# EAGLE design tv-b-gone (EAGLE 4.16)
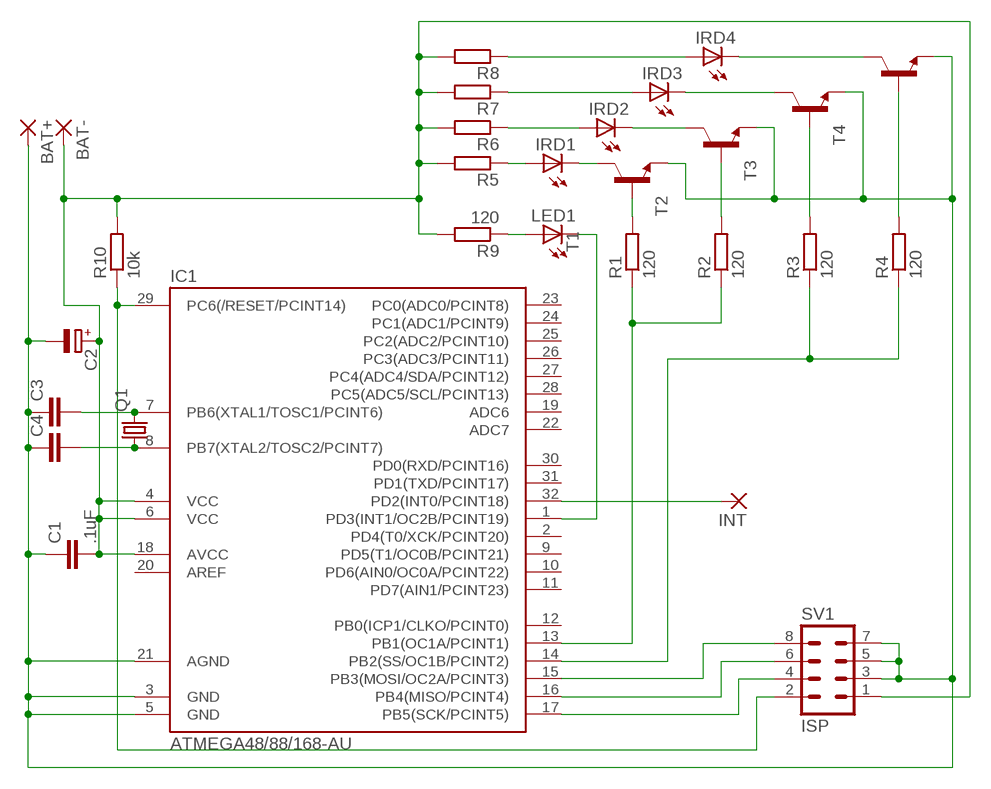
[diagram p0: schematic, sheet 1]

## Parts
BAT+  2,54/0,8  [2,54/0,8]
BAT-  2,54/0,8  [2,54/0,8]
C1  .1uF  C-EUC0603  [C0603]
C2  CPOL-EUCT3216  [CT3216]
C3  C-EUC0603  [C0603]
C4  C-EUC0603  [C0603]
IC1  ATMEGA48/88/168-AU  [TQFP32-08]
INT  1,6/0,8  [1,6/0,8]
IRD1  SFH482  [SFH482]
IRD2  SFH482  [SFH482]
IRD3  SFH482  [SFH482]
IRD4  SFH482  [SFH482]
LED1  LED3MM  [LED3MM]
Q1  CRYSTALHC49U-V  [HC49U-V]
R1  120  R-EU_0204/5  [0204/5]
R2  120  R-EU_0204/5  [0204/5]
R3  120  R-EU_0204/5  [0204/5]
R4  120  R-EU_0204/5  [0204/5]
R5  R-EU_R0805  [R0805]
R6  R-EU_R0805  [R0805]
R7  R-EU_R0805  [R0805]
R8  R-EU_R0805  [R0805]
R9  120  R-EU_R0805  [R0805]
R10  10k  R-EU_R0805  [R0805]
SV1  ISP  MA04-2  [MA04-2]
T1  2N3904  [TO92]
T2  2N3904  [TO92]
T3  2N3904  [TO92]
T4  2N3904  [TO92]

## Nets
GND: BAT+.1(P) C1.1 C2.- C3.1 C4.1 IC1.3(GND) IC1.5(GND) IC1.21(AGND) SV1.3 SV1.5 SV1.7 T1.3(E) T2.3(E) T3.3(E) T4.3(E)
N$1: IC1.29(PC6(/RESET/PCINT14)) R10.1 SV1.2
N$2: IC1.16(PB4(MISO/PCINT4)) SV1.6
N$3: IC1.1(PD3(INT1/OC2B/PCINT19)) LED1.K(C)
N$4: C3.2 IC1.7(PB6(XTAL1/TOSC1/PCINT6)) Q1.2
N$5: IC1.17(PB5(SCK/PCINT5)) SV1.4
N$6: R1.2 T1.2(B)
N$7: R2.2 T2.2(B)
N$8: R3.2 T3.2(B)
N$9: R4.2 T4.2(B)
N$10: IRD4.K(C) T4.1(C)
N$11: IRD3.K(C) T3.1(C)
N$12: IRD2.K(C) T2.1(C)
N$13: IRD1.K(C) T1.1(C)
N$14: IRD1.A R5.1
N$15: IRD2.A R6.1
N$16: IRD3.A R7.1
N$17: IRD4.A R8.1
N$18: IC1.13(PB1(OC1A/PCINT1)) R1.1 R2.1
N$19: LED1.A R9.1
N$20: IC1.15(PB3(MOSI/OC2A/PCINT3)) SV1.8
N$21: IC1.14(PB2(SS/OC1B/PCINT2)) R3.1 R4.1
N$22: C4.2 IC1.8(PB7(XTAL2/TOSC2/PCINT7)) Q1.1
N$23: IC1.32(PD2(INT0/PCINT18)) INT.1(P)
VCC: BAT-.1(P) C1.2 C2.+ IC1.4(VCC) IC1.6(VCC) IC1.18(AVCC) R5.2 R6.2 R7.2 R8.2 R9.2 R10.2 SV1.1
Unconnected: IC1.2(PD4(T0/XCK/PCINT20)) IC1.9(PD5(T1/OC0B/PCINT21)) IC1.10(PD6(AIN0/OC0A/PCINT22)) IC1.11(PD7(AIN1/PCINT23)) IC1.12(PB0(ICP1/CLKO/PCINT0)) IC1.19(ADC6) IC1.20(AREF) IC1.22(ADC7) IC1.23(PC0(ADC0/PCINT8)) IC1.24(PC1(ADC1/PCINT9)) IC1.25(PC2(ADC2/PCINT10)) IC1.26(PC3(ADC3/PCINT11)) IC1.27(PC4(ADC4/SDA/PCINT12)) IC1.28(PC5(ADC5/SCL/PCINT13)) IC1.30(PD0(RXD/PCINT16)) IC1.31(PD1(TXD/PCINT17))

## Library data of the parts
BAT+ BAT- = wirepad:2,54/0,8: THROUGH-HOLE PAD
C1 C3 C4 = rcl:C-EU: CAPACITOR, European symbol
C2 = rcl:CPOL-EU: POLARIZED CAPACITOR, European symbol
IC1 = atmega8:ATMEGA48/88/168
INT = wirepad:1,6/0,8: THROUGH-HOLE PAD
IRD1-IRD4 = led:SFH482: IR LED infrared emitting diode, Infineon
LED1 = led:LED: LED OSRAM: - CHIPLED LG R971, LG N971, LY N971, LG Q971, LY Q971, LO R971, LY R971 LH N974, LH R974 LS Q976, LO Q976, LY Q976 LO Q996 - Hyper CHIPLED LW Q18S LB Q993, LB Q99A, LB R99A - SideLED LS A670, LO A670, LY A670, LG A670, LP A670 LB A673, LV A673, LT A673, LW A673 LH A674 LY A675 LS A676, LA A676, LO A676, LY A676, LW A676 LS A679, LY A679, LG A679 - Hyper Micro SIDELED® LS Y876, LA Y876, LO Y876, LY Y876 LT Y87S - SmartLED LW L88C, LW L88S LB L89C, LB L89S, LG L890 LS L89K, LO L89K, LY L89K LS L896, LA L896, LO L896, LY L896 - TOPLED LS T670, LO T670, LY T670, LG T670, LP T670 LSG T670, LSP T670, LSY T670, LOP T670, LYG T670 LG T671, LOG T671, LSG T671 LB T673, LV T673, LT T673, LW T673 LH T674 LS T676, LA T676, LO T676, LY T676, LB T676, LH T676, LSB T676, LW T676 LB T67C, LV T67C, LT T67C, LS T67K, LO T67K, LY T67K, LW E67C LS E67B, LA E67B, LO E67B, LY E67B, LB E67C, LV E67C, LT E67C LW T67C LS T679, LY T679, LG T679 LS T770, LO T770, LY T770, LG T770, LP T770 LB T773, LV T773, LT T773, LW T773 LH T774 LS E675, LA E675, LY E675, LS T675 LS T776, LA T776, LO T776, LY T776, LB T776 LHGB T686 LT T68C, LB T68C - Hyper Mini TOPLED® LB M676 - Mini TOPLED Santana® LG M470 LS M47K, LO M47K, LY M47K Source: http://www.osram.convergy.de - LUMILED® LXK2-PW12-R00, LXK2-PW12-S00, LXK2-PW14-U00, LXK2-PW14-V00 LXK2-PM12-R00, LXK2-PM12-S00, LXK2-PM14-U00 LXK2-PE12-Q00, LXK2-PE12-R00, LXK2-PE12-S00, LXK2-PE14-T00, LXK2-PE14-U00 LXK2-PB12-K00, LXK2-PB12-L00, LXK2-PB12-M00, LXK2-PB14-N00, LXK2-PB14-P00, LXK2-PB14-Q00 LXK2-PR12-L00, LXK2-PR12-M00, LXK2-PR14-Q00, LXK2-PR14-R00 LXK2-PD12-Q00, LXK2-PD12-R00, LXK2-PD12-S00 LXK2-PH12-R00, LXK2-PH12-S00 LXK2-PL12-P00, LXK2-PL12-Q00, LXK2-PL12-R00 Source: www.luxeon.com
Q1 = crystal:CRYSTAL: CRYSTAL
R1-R10 = rcl:R-EU_: RESISTOR, European symbol
SV1 = con-lstb:MA04-2: PIN HEADER
T1-T4 = transistor:2N3904: NPN TRANSISTOR

## Board
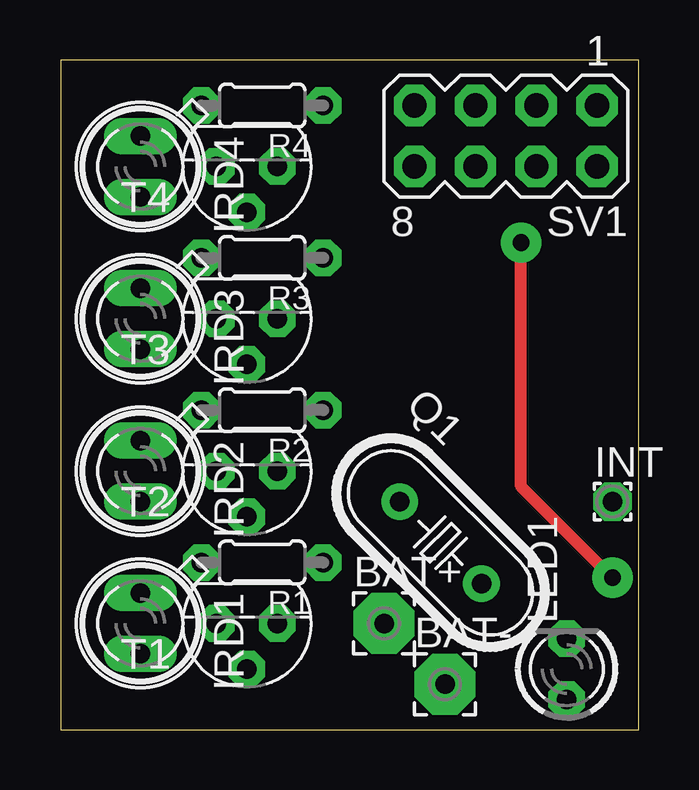
[diagram p1: board, top side]
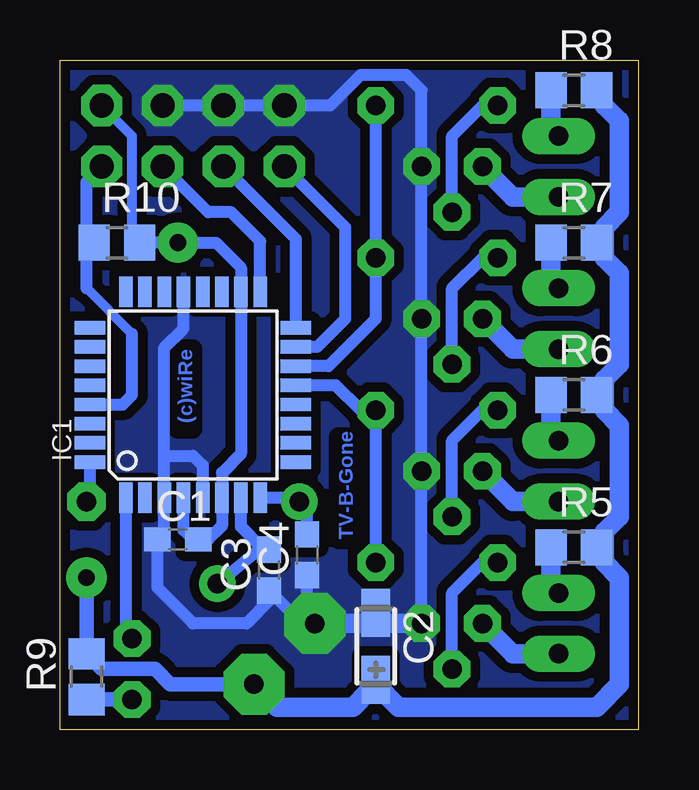
[diagram p2: board, bottom side, seen from below]

Size 24.12 x 27.93 mm. Coordinates in mm from the lower left corner, seen from the top.
Outline: 0,0 24.12,0 24.12,27.93 0,27.93 0,0
Copper layers (1*16): Top 0.035mm / dielectric 1.5mm / Bottom 0.035mm
Design rules "default": minimum track width 10mil, minimum drill 24mil, track to track 10mil, track to pad 10mil, pad to pad 10mil, via to via 10mil, smd to smd 0mil, copper to edge 1mil, drill to drill 8mil, minimum pad ring 14mil, minimum via ring 14mil, stop-mask expansion 4mil, vias tented up to drill 0mil, thermal gap 10mil

### Footprints (pad centres in the part's own frame; a part is rotated, then mirrored left to right if it is on the bottom)
2,54/0,8 = drill 0.813 pad 2.54 octagon: 1 0,0
C0603 = smd 1.1 x 1: 1 -0.85,0; 2 0.85,0
CT3216 = smd 2 x 1.2: + 1.4,0; - -1.4,0
TQFP32-08 = smd 1.27 x 0.559: 1 -4.293,2.8; 2 -4.293,2; 3 -4.293,1.2; 4 -4.293,0.4; 5 -4.293,-0.4; 6 -4.293,-1.2; 7 -4.293,-2; 8 -4.293,-2.8; 17 4.293,-2.8; 18 4.293,-2; 19 4.293,-1.2; 20 4.293,-0.4; 21 4.293,0.4; 22 4.293,1.2; 23 4.293,2; 24 4.293,2.8 | smd 0.559 x 1.27: 9 -2.8,-4.293; 10 -2,-4.293; 11 -1.2,-4.293; 12 -0.4,-4.293; 13 0.4,-4.293; 14 1.2,-4.293; 15 2,-4.293; 16 2.8,-4.293; 25 2.8,4.293; 26 2,4.293; 27 1.2,4.293; 28 0.4,4.293; 29 -0.4,4.293; 30 -1.2,4.293; 31 -2,4.293; 32 -2.8,4.293
1,6/0,8 = drill 0.813 pad 1.6 octagon: 1 0,0
SFH482 = drill 0.813 long: A -1.27,0; K 1.27,0
LED3MM = drill 0.813 octagon: A -1.27,0; K 1.27,0
HC49U-V = drill 0.813 round: 1 -2.413,0; 2 2.413,0
0204/5 = drill 0.813 octagon: 1 -2.54,0; 2 2.54,0
R0805 = smd 1.3 x 1.5: 1 -0.95,0; 2 0.95,0
MA04-2 = drill 1.016 octagon: 1 -3.81,-1.27; 2 -3.81,1.27; 3 -1.27,-1.27; 4 -1.27,1.27; 5 1.27,-1.27; 6 1.27,1.27; 7 3.81,-1.27; 8 3.81,1.27
TO92 = drill 0.813 octagon: 1 1.27,0; 2 0,1.905; 3 -1.27,0

### Placement (x,y rotation side)
BAT+  13.49,4.44 0 top
BAT-  16.03,1.9 0 top
C1  19.2,7.93 0 bottom
C2  10.95,3.49 270 bottom
C3  15.39,6.66 90 bottom
C4  13.8,7.3 90 bottom
IC1  18.57,13.97 90 bottom
INT  23.01,9.52 0 top
IRD1  3.33,4.44 270 top
IRD2  3.33,10.79 270 top
IRD3  3.33,17.14 270 top
IRD4  3.33,23.49 270 top
LED1  21.11,2.54 90 top
Q1  15.84,7.8 315 top
R1  8.41,6.98 180 top
R2  8.41,13.33 180 top
R3  8.41,19.68 180 top
R4  8.41,26.03 180 top
R5  2.69,7.62 0 bottom
R6  2.69,13.97 0 bottom
R7  2.69,20.31 0 bottom
R8  2.69,26.66 0 bottom
R9  23.01,2.22 90 bottom
R10  21.74,20.31 0 bottom
SV1  18.57,24.76 180 top
T1  7.77,4.44 180 top
T2  7.77,10.79 180 top
T3  7.77,17.14 180 top
T4  7.77,23.49 180 top

### Tracks (layer width: path | path; a pad name or v marks a point on that pad's centre or on a via)
GND
  Bottom 0.508: SV1.3 SV1.5 12.85,26.03 | IC1.5 18.17,11.03 18.57,11.43 19.77,11.43 | 19.77,11.43 IC1.3 19.77,8.32 19.84,8.25 C1.1 20.05,5.92 18.57,4.44 16.34,4.44 15.39,5.39 C3.1 14.02,4.44 13.81,4.44 | 19.77,11.43 19.77,15.94 18.97,16.74 IC1.21 | BAT+.1 13.81,4.44 | 13.81,4.44 C4.1 | T1.3 T2.3 T3.3 T4.3 9.04,26.66 9.68,27.3 11.58,27.3 12.85,26.03 | 12.85,26.03 SV1.7
  Bottom 0.61: T1.3 10.95,4.44
  Bottom 0.813: T1.3 BAT+.1
  pour Bottom (isolate 0.406, no thermals): -0.17,27.93 24.28,27.93 24.28,-0.01 -0.17,-0.01
N$1
  Bottom 0.406: 21.11,16.5 23.01,18.41 | 23.01,20 R10.1
  Bottom 0.508: IC1.29 21.51,13.57 21.11,13.97 21.11,16.5 | 23.01,18.41 23.01,20 23.01,22.86 SV1.2
N$2
  Bottom 0.508: IC1.16 14.27,20.47 SV1.6
N$3
  Bottom 0.508: IC1.1 21.37,4.18 LED1.K
N$4
  Bottom 0.508: IC1.7 16.57,8.47 15.71,7.62 | C3.2 15.39,7.62 15.71,7.62 | Q1.2 | 15.71,7.62 Q1.2
N$5
  Bottom 0.508: IC1.17 15.77,20.37 16.98,21.58 17.93,21.58 SV1.4
N$6
  Bottom 0.508: T1.2 7.77,5.71 6.5,6.98 R1.2
N$7
  Bottom 0.508: T2.2 7.77,12.06 6.5,13.33 R2.2
N$8
  Bottom 0.508: T3.2 7.77,18.41 6.5,19.68 R3.2
N$9
  Bottom 0.508: T4.2 7.77,24.76 6.5,26.03 R4.2
N$10
  Bottom 0.813: IRD4.K 5.23,22.22 T4.1
N$11
  Bottom 0.813: IRD3.K 5.23,15.87 T3.1
N$12
  Bottom 0.813: IRD2.K 5.23,9.52 T2.1
N$13
  Bottom 0.813: IRD1.K 5.23,3.17 T1.1
N$14
  Bottom 0.813: R5.1 3.64,6.02 IRD1.A
N$15
  Bottom 0.813: R6.1 3.64,12.38 IRD2.A
N$16
  Bottom 0.813: R7.1 3.64,18.72 IRD3.A
N$17
  Bottom 0.813: R8.1 3.64,25.07 IRD4.A
N$18
  Bottom 0.508: R1.1 R2.1 11.58,13.33 12.62,14.37 IC1.13
N$19
  Bottom 0.61: R9.1 LED1.A
N$20
  Bottom 0.508: IC1.15 13.39,15.97 12.22,17.14 12.22,20.95 SV1.8
N$21
  Bottom 0.508: R4.1 R3.1 10.95,17.14 12.92,15.17 IC1.14
N$22
  Bottom 0.508: Q1.1 14.12,9.52 14.27,9.67 IC1.8 | Q1.1 | Q1.1 13.81,9.18 C4.2
N$23
  Bottom 0.508: IC1.32 22.86,9.67 INT.1
VCC  (via drill 0.7 pad 1.68)
  Top 0.508: v23.01,6.34 19.2,10.16 v19.2,20.31
  Bottom 0.406: R5.2 2.06,7.62 1.42,8.25 | SV1.1 21.11,24.76 21.11,20.63 R10.2
  Bottom 0.508: IC1.4 18.97,8.33 18.57,7.93 | 18.57,7.93 C1.2 | 18.57,7.93 17.93,7.93 17.37,8.5 IC1.6 17.37,10.72 16.57,11.52 IC1.18 16.57,19.27 17.62,20.31 v19.2,20.31 R10.2 | 10.95,1.9 11.26,1.58 C2.+
  Bottom 0.61: BAT-.1 19.52,1.9 20.15,2.54 22.38,2.54 R9.2 v23.01,6.34
  Bottom 0.813: R5.2 1.74,7.93 | 1.42,13.33 0.79,12.7 0.79,8.89 1.42,8.25 1.42,6.98 0.79,6.34 0.79,1.9 1.74,0.95 9.99,0.95 10.95,1.9 | 1.42,13.33 R6.2 | 1.42,13.33 1.42,14.6 0.79,15.24 0.79,19.04 1.42,19.68 | 1.42,19.68 R7.2 | 1.42,19.68 1.42,20.95 0.79,21.58 0.79,25.39 1.42,26.03 R8.2 | 11.26,1.58 11.9,0.95 15.07,0.95 BAT-.1

### Text on the board
Bottom: (c)wiRe | TV-B-Gone